# EAGLE schematic MaTouch ESP32-S3 7.5“ Eink AI Mic Array V1.0 (EAGLE 6.1)
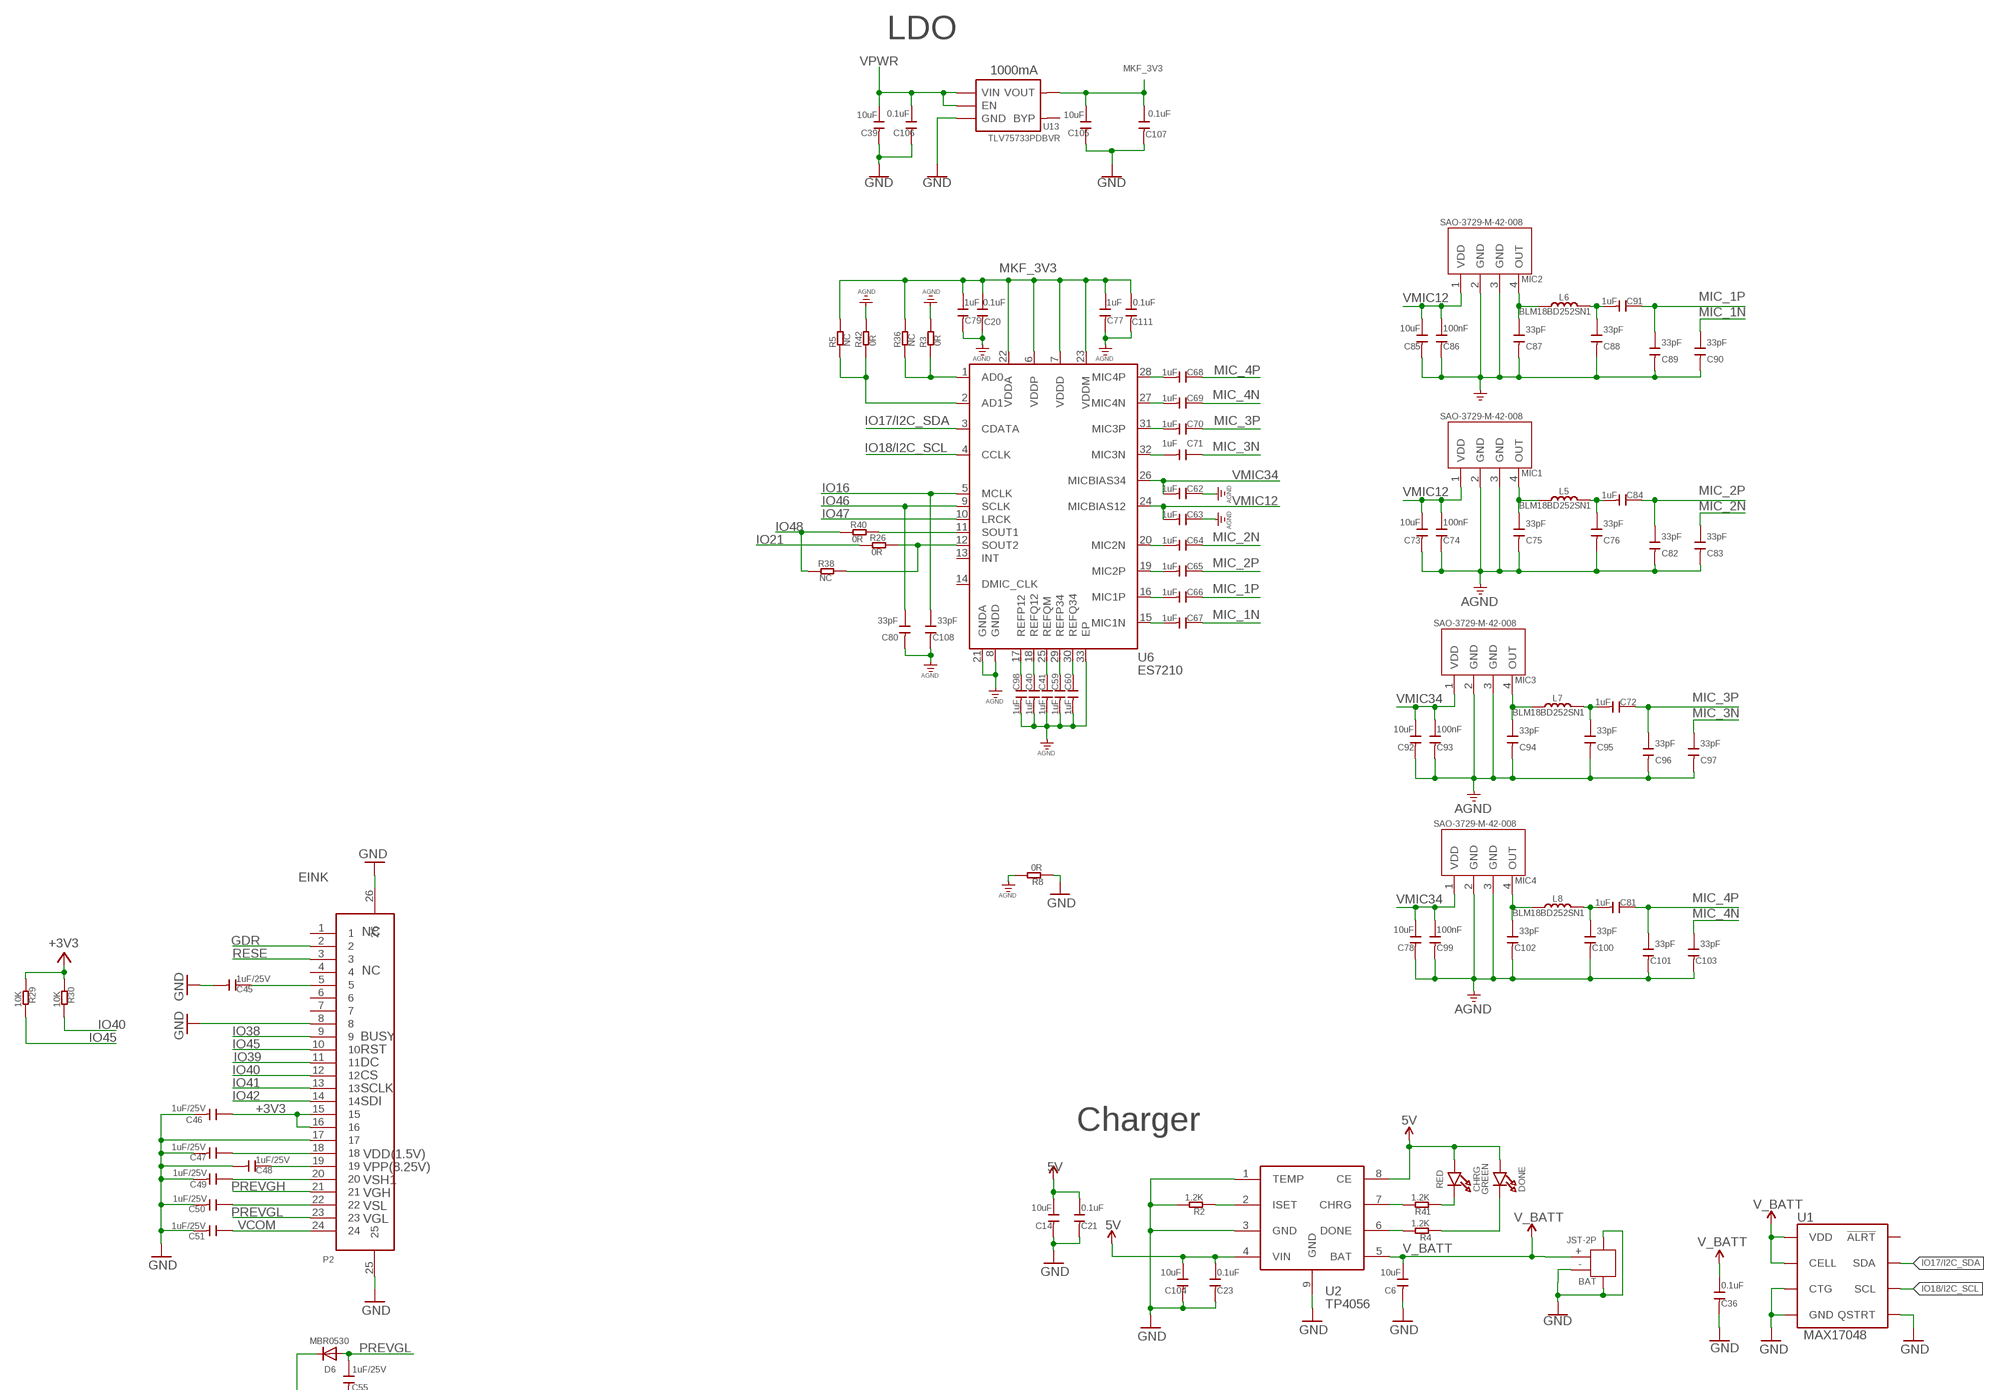
[diagram p0: schematic, sheet 1, part 1 of 3]
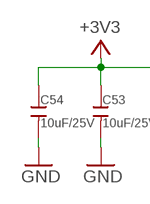
[diagram p1: schematic, sheet 1, part 2 of 3]
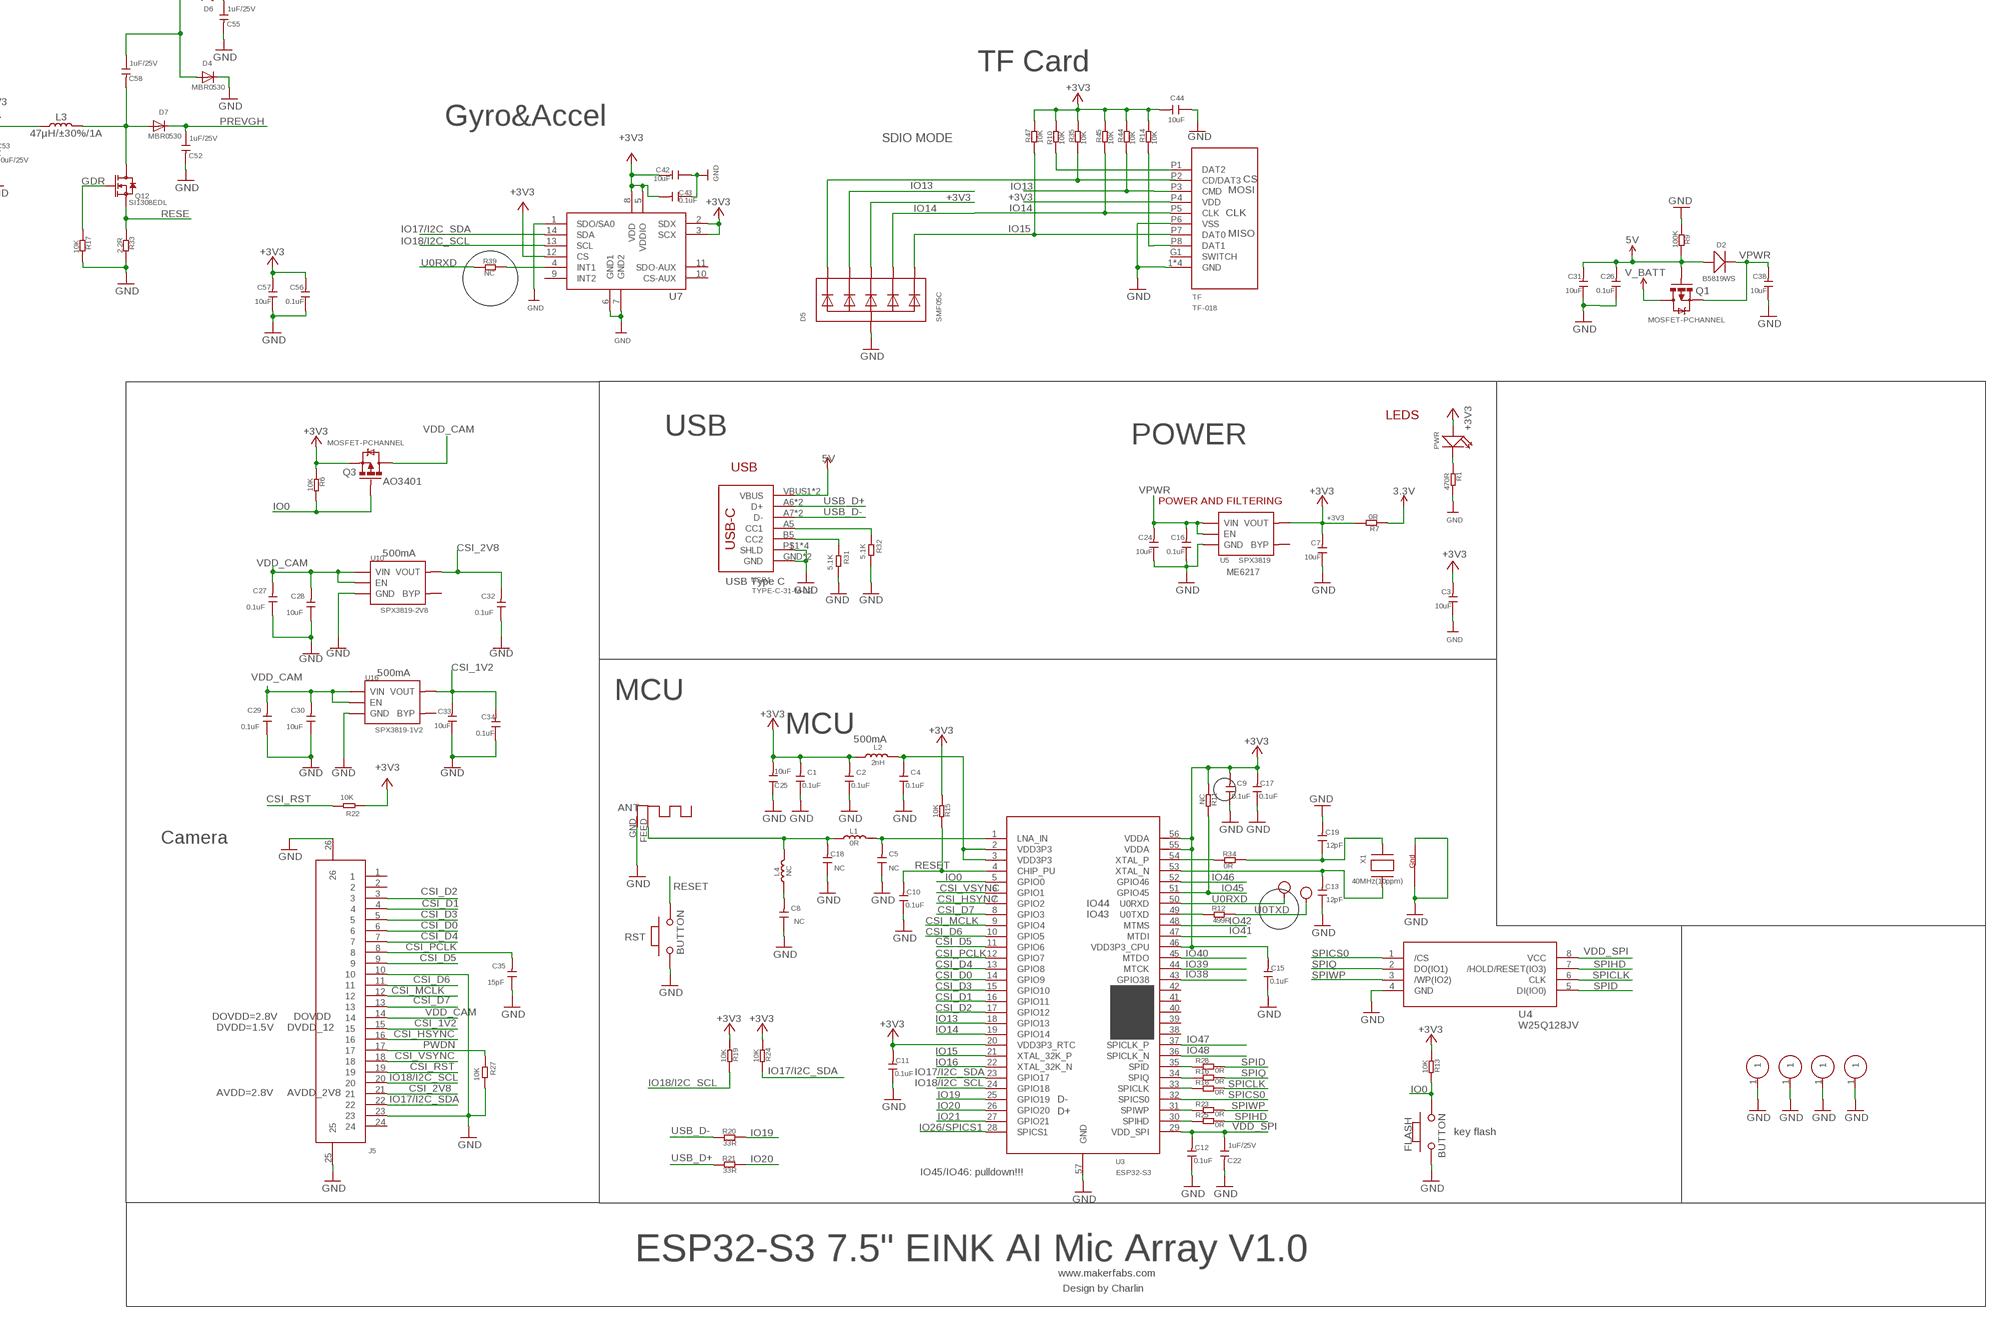
[diagram p2: schematic, sheet 1, part 3 of 3]

## Parts
ANT1  ANTENNA  [RN-ANT]
BAT  JST-2P  JST-2P-SMD'2.0'  [HW2-SMD-2.0-90D]
C1  0.1uF  DISCRETE_C-0402  [DISCRETE_C0402]
C2  0.1uF  DISCRETE_C-0402  [DISCRETE_C0402]
C3  10uF  DISCRETE_C-0402  [DISCRETE_C0402]
C4  0.1uF  DISCRETE_C-0402  [DISCRETE_C0402]
C5  NC  DISCRETE_C-0402  [DISCRETE_C0402]
C6  10uF  DISCRETE_C-0402  [DISCRETE_C0402]
C7  10uF  DISCRETE_C-0402  [DISCRETE_C0402]
C8  NC  DISCRETE_C-0402  [DISCRETE_C0402]
C9  0.1uF  DISCRETE_C-0402  [DISCRETE_C0402]
C10  0.1uF  DISCRETE_C-0402  [DISCRETE_C0402]
C11  0.1uF  DISCRETE_C-0402  [DISCRETE_C0402]
C12  0.1uF  DISCRETE_C-0402  [DISCRETE_C0402]
C13  12pF  DISCRETE_C-0402  [DISCRETE_C0402]
C14  10uF  DISCRETE_C-0402  [DISCRETE_C0402]
C15  0.1uF  DISCRETE_C-0402  [DISCRETE_C0402]
C16  0.1uF  DISCRETE_C-0402  [DISCRETE_C0402]
C17  0.1uF  DISCRETE_C-0402  [DISCRETE_C0402]
C18  NC  DISCRETE_C-0402  [DISCRETE_C0402]
C19  12pF  DISCRETE_C-0402  [DISCRETE_C0402]
C20  0.1uF  DISCRETE_C-0402  [DISCRETE_C0402]
C21  0.1uF  DISCRETE_C-0402  [DISCRETE_C0402]
C22  1uF/25V  DISCRETE_C-0402  [DISCRETE_C0402]
C23  0.1uF  DISCRETE_C-0402  [DISCRETE_C0402]
C24  10uF  DISCRETE_C-0402  [DISCRETE_C0402]
C25  10uF  DISCRETE_C-0603  [DISCRETE_C0603]
C26  0.1uF  DISCRETE_C-0402  [DISCRETE_C0402]
C27  0.1uF  DISCRETE_C-0402  [DISCRETE_C0402]
C28  10uF  DISCRETE_C-0402  [DISCRETE_C0402]
C29  0.1uF  DISCRETE_C-0402  [DISCRETE_C0402]
C30  10uF  DISCRETE_C-0402  [DISCRETE_C0402]
C31  10uF  DISCRETE_C-0402  [DISCRETE_C0402]
C32  0.1uF  DISCRETE_C-0402  [DISCRETE_C0402]
C33  10uF  DISCRETE_C-0402  [DISCRETE_C0402]
C34  0.1uF  DISCRETE_C-0402  [DISCRETE_C0402]
C35  15pF  DISCRETE_C-0402  [DISCRETE_C0402]
C36  0.1uF  DISCRETE_C-0402  [DISCRETE_C0402]
C38  10uF  DISCRETE_C-0402  [DISCRETE_C0402]
C39  10uF  DISCRETE_C-0402  [DISCRETE_C0402]
C40  1uF  DISCRETE_C-0402  [DISCRETE_C0402]
C41  1uF  DISCRETE_C-0402  [DISCRETE_C0402]
C42  10uF  DISCRETE_C-0402  [DISCRETE_C0402]
C43  0.1uF  DISCRETE_C-0402  [DISCRETE_C0402]
C44  10uF  DISCRETE_C-0402  [DISCRETE_C0402]
C45  1uF/25V  DISCRETE_C-0402  [DISCRETE_C0402]
C46  1uF/25V  DISCRETE_C-0402  [DISCRETE_C0402]
C47  1uF/25V  DISCRETE_C-0402  [DISCRETE_C0402]
C48  1uF/25V  DISCRETE_C-0402  [DISCRETE_C0402]
C49  1uF/25V  DISCRETE_C-0402  [DISCRETE_C0402]
C50  1uF/25V  DISCRETE_C-0402  [DISCRETE_C0402]
C51  1uF/25V  DISCRETE_C-0402  [DISCRETE_C0402]
C52  1uF/25V  DISCRETE_C-0402  [DISCRETE_C0402]
C53  10uF/25V  C-0603  [C0603]
C54  10uF/25V  C-0603  [C0603]
C55  1uF/25V  DISCRETE_C-0402  [DISCRETE_C0402]
C56  0.1uF  DISCRETE_C-0402  [DISCRETE_C0402]
C57  10uF  DISCRETE_C-0402  [DISCRETE_C0402]
C58  1uF/25V  DISCRETE_C-0402  [DISCRETE_C0402]
C59  1uF  DISCRETE_C-0402  [DISCRETE_C0402]
C60  1uF  DISCRETE_C-0402  [DISCRETE_C0402]
C62  1uF  DISCRETE_C-0402  [DISCRETE_C0402]
C63  1uF  DISCRETE_C-0402  [DISCRETE_C0402]
C64  1uF  DISCRETE_C-0402  [DISCRETE_C0402]
C65  1uF  DISCRETE_C-0402  [DISCRETE_C0402]
C66  1uF  DISCRETE_C-0402  [DISCRETE_C0402]
C67  1uF  DISCRETE_C-0402  [DISCRETE_C0402]
C68  1uF  DISCRETE_C-0402  [DISCRETE_C0402]
C69  1uF  DISCRETE_C-0402  [DISCRETE_C0402]
C70  1uF  DISCRETE_C-0402  [DISCRETE_C0402]
C71  1uF  DISCRETE_C-0402  [DISCRETE_C0402]
C72  1uF  DISCRETE_C-0402  [DISCRETE_C0402]
C73  10uF  DISCRETE_C-0402  [DISCRETE_C0402]
C74  100nF  DISCRETE_C-0402  [DISCRETE_C0402]
C75  33pF  DISCRETE_C-0402  [DISCRETE_C0402]
C76  33pF  DISCRETE_C-0402  [DISCRETE_C0402]
C77  1uF  DISCRETE_C-0402  [DISCRETE_C0402]
C78  10uF  DISCRETE_C-0402  [DISCRETE_C0402]
C79  1uF  DISCRETE_C-0402  [DISCRETE_C0402]
C80  33pF  DISCRETE_C-0402  [DISCRETE_C0402]
C81  1uF  DISCRETE_C-0402  [DISCRETE_C0402]
C82  33pF  DISCRETE_C-0402  [DISCRETE_C0402]
C83  33pF  DISCRETE_C-0402  [DISCRETE_C0402]
C84  1uF  DISCRETE_C-0402  [DISCRETE_C0402]
C85  10uF  DISCRETE_C-0402  [DISCRETE_C0402]
C86  100nF  DISCRETE_C-0402  [DISCRETE_C0402]
C87  33pF  DISCRETE_C-0402  [DISCRETE_C0402]
C88  33pF  DISCRETE_C-0402  [DISCRETE_C0402]
C89  33pF  DISCRETE_C-0402  [DISCRETE_C0402]
C90  33pF  DISCRETE_C-0402  [DISCRETE_C0402]
C91  1uF  DISCRETE_C-0402  [DISCRETE_C0402]
C92  10uF  DISCRETE_C-0402  [DISCRETE_C0402]
C93  100nF  DISCRETE_C-0402  [DISCRETE_C0402]
C94  33pF  DISCRETE_C-0402  [DISCRETE_C0402]
C95  33pF  DISCRETE_C-0402  [DISCRETE_C0402]
C96  33pF  DISCRETE_C-0402  [DISCRETE_C0402]
C97  33pF  DISCRETE_C-0402  [DISCRETE_C0402]
C98  1uF  DISCRETE_C-0402  [DISCRETE_C0402]
C99  100nF  DISCRETE_C-0402  [DISCRETE_C0402]
C100  33pF  DISCRETE_C-0402  [DISCRETE_C0402]
C101  33pF  DISCRETE_C-0402  [DISCRETE_C0402]
C102  33pF  DISCRETE_C-0402  [DISCRETE_C0402]
C103  33pF  DISCRETE_C-0402  [DISCRETE_C0402]
C104  10uF  DISCRETE_C-0402  [DISCRETE_C0402]
C105  10uF  DISCRETE_C-0402  [DISCRETE_C0402]
C106  0.1uF  DISCRETE_C-0402  [DISCRETE_C0402]
C107  0.1uF  DISCRETE_C-0402  [DISCRETE_C0402]
C108  33pF  DISCRETE_C-0402  [DISCRETE_C0402]
C111  0.1uF  DISCRETE_C-0402  [DISCRETE_C0402]
CHRG  RED  LED0805_NOOUTLINE  [CHIPLED_0805_NOOUTLINE]
D2  B5819WS  D'0805'  [SOD323]
D4  MBR0530  DIODESOD-323F  [SOD-323F]
D5  SMF05C  TVSARRAY_5LANE  [SOT363]
D6  MBR0530  DIODESOD-323F  [SOD-323F]
D7  MBR0530  DIODESOD-323F  [SOD-323F]
DONE  GREEN  LED0805_NOOUTLINE  [CHIPLED_0805_NOOUTLINE]
FLASH  BUTTON  PB157  [157SW]
J5  FPC-24P  [SMD26-50P-1760L450W]
L1  0R  DISCRETE_L0402  [DISCRETE_L0402]
L2  2nH  DISCRETE_L0603  [DISCRETE_L0603]
L3  47µH/±30%/1A  INDUCTOR-CR54-47UH  [CR54]
L4  NC  DISCRETE_L0402  [DISCRETE_L0402]
L5  BLM18BD252SN1  INDUCTOR/FERRITE-BEAD'0603'  [L0603]
L6  BLM18BD252SN1  INDUCTOR/FERRITE-BEAD'0603'  [L0603]
L7  BLM18BD252SN1  INDUCTOR/FERRITE-BEAD'0603'  [L0603]
L8  BLM18BD252SN1  INDUCTOR/FERRITE-BEAD'0603'  [L0603]
MIC1  SAO-3729-M-42-008  MIC-MSM421A3729H8-C  [MIC4-SMD-3.76X2.95MM]
MIC2  SAO-3729-M-42-008  MIC-MSM421A3729H8-C  [MIC4-SMD-3.76X2.95MM]
MIC3  SAO-3729-M-42-008  MIC-MSM421A3729H8-C  [MIC4-SMD-3.76X2.95MM]
MIC4  SAO-3729-M-42-008  MIC-MSM421A3729H8-C  [MIC4-SMD-3.76X2.95MM]
P2  FPC-24P  [SMD26-50P-1760L450W]
PWR  DISCRETE_LED0603  [DISCRETE_LED-0603]
Q1  MOSFET-PCHANNEL  [SOT23-3]
Q3  MOSFET-PCHANNEL  [SOT23-3]
Q12  SI1308EDL  MOSFET-N'SOT23'  [SOT23]
R1  470R  DISCRETE_R-0402  [DISCRETE_R0402]
R2  1.2K  DISCRETE_R-0402  [DISCRETE_R0402]
R3  0R  DISCRETE_R-0402  [DISCRETE_R0402]
R4  1.2K  DISCRETE_R-0402  [DISCRETE_R0402]
R5  NC  DISCRETE_R-0402  [DISCRETE_R0402]
R6  10K  DISCRETE_R-0402  [DISCRETE_R0402]
R7  0R  DISCRETE_R-0402  [DISCRETE_R0402]
R8  0R  DISCRETE_R-0402  [DISCRETE_R0402]
R9  100K  DISCRETE_R-0402  [DISCRETE_R0402]
R10  10K  DISCRETE_R-0402  [DISCRETE_R0402]
R11  NC  DISCRETE_R-0402  [DISCRETE_R0402]
R12  499R  DISCRETE_R-0402  [DISCRETE_R0402]
R13  10K  DISCRETE_R-0402  [DISCRETE_R0402]
R14  10K  DISCRETE_R-0402  [DISCRETE_R0402]
R15  10K  DISCRETE_R-0402  [DISCRETE_R0402]
R16  0R  DISCRETE_R-0402  [DISCRETE_R0402]
R17  10K  DISCRETE_R-0402  [DISCRETE_R0402]
R18  0R  DISCRETE_R-0402  [DISCRETE_R0402]
R19  10K  DISCRETE_R-0402  [DISCRETE_R0402]
R20  33R  DISCRETE_R-0402  [DISCRETE_R0402]
R21  33R  DISCRETE_R-0402  [DISCRETE_R0402]
R22  10K  DISCRETE_R-0402  [DISCRETE_R0402]
R23  0R  DISCRETE_R-0402  [DISCRETE_R0402]
R24  10K  DISCRETE_R-0402  [DISCRETE_R0402]
R25  0R  DISCRETE_R-0402  [DISCRETE_R0402]
R26  0R  DISCRETE_R-0402  [DISCRETE_R0402]
R27  10K  DISCRETE_R-0402  [DISCRETE_R0402]
R28  0R  DISCRETE_R-0402  [DISCRETE_R0402]
R29  10K  DISCRETE_R-0402  [DISCRETE_R0402]
R30  10K  DISCRETE_R-0402  [DISCRETE_R0402]
R31  5.1K  DISCRETE_R-0402  [DISCRETE_R0402]
R32  5.1K  DISCRETE_R-0402  [DISCRETE_R0402]
R33  2.2R  DISCRETE_R-0402  [DISCRETE_R0402]
R34  0R  DISCRETE_R-0402  [DISCRETE_R0402]
R35  10K  DISCRETE_R-0402  [DISCRETE_R0402]
R36  NC  DISCRETE_R-0402  [DISCRETE_R0402]
R38  NC  DISCRETE_R-0402  [DISCRETE_R0402]
R39  NC  DISCRETE_R-0402  [DISCRETE_R0402]
R40  0R  DISCRETE_R-0402  [DISCRETE_R0402]
R41  1.2K  DISCRETE_R-0402  [DISCRETE_R0402]
R42  0R  DISCRETE_R-0402  [DISCRETE_R0402]
R44  10K  DISCRETE_R-0402  [DISCRETE_R0402]
R45  10K  DISCRETE_R-0402  [DISCRETE_R0402]
R47  10K  DISCRETE_R-0402  [DISCRETE_R0402]
RST  BUTTON  PB157  [157SW]
RX  TEST-POINT'4545'  [TP-D45MIL]
S1  ONEPIN01  [ONEPIN01]
S2  ONEPIN01  [ONEPIN01]
S3  ONEPIN01  [ONEPIN01]
S4  ONEPIN01  [ONEPIN01]
TF  TF-018  [TF-018]
TX  TEST-POINT'4545'  [TP-D45MIL]
U1  MAX17048  MAX17048DFN8  [DFN-8]
U2  TP4056  [SOP8-1.27P]
U3  ESP32-S3  [QFN56-7*7MM]
U4  W25Q128JV  [SOIC-8-208MIL]
U5  SPX3819  [SOT23-5]
U6  ES7210  [QFN33-40P400L400W75H-280X280]
U7  QMI8658A  [LGA14-50P-300L250W86H]
U10  SPX3819-2V8  SPX3819  [SOT23-5]
U13  TLV75733PDBVR  SPX3819  [SOT23-5]
U16  SPX3819-1V2  SPX3819  [SOT23-5]
USB1  TYPE-C-31-M-12  [TYPE-C-31-M-12]
X1  40MHz(10ppm)  XTAL-4-3225  [NX3225]

## Nets
3.3V: R7.2
5V: C14.1 C21.1 C23.1 C26.2 C31.2 C104.1 CHRG.A D2.+ DONE.A Q1.1(G) R9.2 U2.4(VIN) U2.8(CE) USB1.VBUS1(VBUS) USB1.VBUS2(VBUS)
+3V3: C1.2 C2.2 C3.2 C7.2 C9.2 C11.2 C15.2 C17.2 C25.2 C42.2 C43.2 C44.2 C46.1 C53.1 C54.1 C56.2 C57.2 D5.4(C3) L2.1 L3.P$1 P2.15 P2.16 PWR.+ Q3.2(S) R6.2 R7.1 R10.2 R11.2 R13.2 R14.2 R15.2 R19.2 R22.1 R24.2 R29.1 R30.1 R35.2 R44.2 R45.2 R47.2 TF.P4(VDD) U3.20(VDD3P3_RTC) U3.46(VDD3P3_CPU) U3.55(VDDA) U3.56(VDDA) U5.5(VOUT) U7.2(SDX) U7.3(SCX) U7.5(VDDIO) U7.8(VDD) U7.12(CS)
AGND: C20.2 C40.2 C41.2 C59.2 C60.2 C62.1 C63.1 C73.2 C74.2 C75.2 C76.2 C77.2 C78.2 C79.2 C80.2 C82.2 C83.2 C85.2 C86.2 C87.2 C88.2 C89.2 C90.2 C92.2 C93.2 C94.2 C95.2 C96.2 C97.2 C98.2 C99.2 C100.2 C101.2 C102.2 C103.2 C108.2 C111.2 MIC1.2(GND) MIC1.3(GND) MIC2.2(GND) MIC2.3(GND) MIC3.2(GND) MIC3.3(GND) MIC4.2(GND) MIC4.3(GND) R3.1 R8.1 R42.1 U6.8(GNDD) U6.21(GNDA) U6.33(EP) ; supply symbol labelled GND_POWER
CSI_1V2: C33.2 C34.2 J5.15 U16.5(VOUT)
CSI_2V8: C32.2 J5.21 U10.5(VOUT)
CSI_D0: J5.6 U3.14(GPIO9)
CSI_D1: J5.4 U3.16(GPIO11)
CSI_D2: J5.3 U3.17(GPIO12)
CSI_D3: J5.5 U3.15(GPIO10)
CSI_D4: J5.7 U3.13(GPIO8)
CSI_D5: J5.9 U3.11(GPIO6)
CSI_D6: J5.11 U3.10(GPIO5)
CSI_D7: J5.13 U3.8(GPIO3)
CSI_HSYNC: J5.16 U3.7(GPIO2)
CSI_MCLK: J5.12 U3.9(GPIO4)
CSI_PCLK: C35.2 J5.8 U3.12(GPIO7)
CSI_RST: J5.19 R22.2
CSI_VSYNC: J5.18 U3.6(GPIO1)
GDR: P2.2 Q12.1(G) R17.1
GND: ANT1.GND BAT.3 BAT.4 BAT.- C1.1 C2.1 C3.1 C4.1 C5.1 C6.2 C7.1 C8.1 C9.1 C10.1 C11.1 C12.1 C13.1 C14.2 C15.1 C16.1 C17.1 C18.1 C19.2 C21.2 C22.2 C23.2 C24.1 C25.1 C26.1 C27.1 C28.1 C29.1 C30.1 C31.1 C32.1 C33.1 C34.1 C35.1 C36.2 C38.1 C39.2 C42.1 C43.1 C44.1 C45.2 C46.2 C47.2 C48.2 C49.2 C50.2 C51.2 C52.2 C53.2 C54.2 C55.2 C56.1 C57.1 C104.2 C105.2 C106.2 C107.2 D4.C D5.2(A) FLASH.1 J5.10 J5.23 J5.25 J5.26 P2.8 P2.17 P2.25 P2.26 R1.1 R2.1 R8.2 R9.1 R17.2 R27.2 R31.2 R32.2 R33.2 RST.1 S1.1 S2.1 S3.1 S4.1 TF.1(GND) TF.2(GND) TF.3(GND) TF.4(GND) TF.P6(VSS) U1.1(CTG) U1.4(GND) U1.6(QSTRT) U1.9(GND) U2.1(TEMP) U2.3(GND) U2.9(GND) U3.57(GND) U4.4(GND) U5.2(GND) U7.1(SDO/SA0) U7.6(GND1) U7.7(GND2) U10.2(GND) U13.2(GND) U16.2(GND) USB1.GND USB1.GND2(GND) USB1.P$1(SHLD) USB1.P$2(SHLD) USB1.P$3(SHLD) USB1.P$4(SHLD) X1.2(G2) X1.4(G1)
IO0: FLASH.2 Q3.1(G) R6.1 R13.1 U3.5(GPIO0)
IO13: D5.3(C2) R44.1 TF.P3(CMD) U3.18(GPIO13)
IO14: D5.5(C4) R45.1 TF.P5(CLK) U3.19(GPIO14)
IO15: D5.6(C5) R47.1 TF.P7(DAT0) U3.21(XTAL_32K_P)
IO16: C108.1 U3.22(XTAL_32K_N) U6.5(MCLK)
IO17/I2C_SDA: J5.22 R24.1 U1.8(SDA) U3.23(GPIO17) U6.3(CDATA) U7.14(SDA)
IO18/I2C_SCL: J5.20 R19.1 U1.7(SCL) U3.24(GPIO18) U6.4(CCLK) U7.13(SCL)
IO19: R20.1 U3.25(GPIO19)
IO20: R21.1 U3.26(GPIO20)
IO21: R26.2 U3.27(GPIO21)
IO26/SPICS1: U3.28(SPICS1)
IO38: P2.9 U3.43(GPIO38)
IO39: P2.11 U3.44(MTCK)
IO40: P2.12 R30.2 U3.45(MTDO)
IO41: P2.13 U3.47(MTDI)
IO42: P2.14 U3.48(MTMS)
IO45: P2.10 R11.1 R29.2 U3.51(GPIO45)
IO46: C80.1 U3.52(GPIO46) U6.9(SCLK)
IO47: U3.37(SPICLK_P) U6.10(LRCK)
IO48: R38.2 R40.2 U3.36(SPICLK_N)
MIC_1N: C67.1 C90.1
MIC_1P: C66.1 C89.1 C91.1
MIC_2N: C64.1 C83.1
MIC_2P: C65.1 C82.1 C84.1
MIC_3N: C71.1 C97.1
MIC_3P: C70.1 C72.1 C96.1
MIC_4N: C69.1 C103.1
MIC_4P: C68.1 C81.1 C101.1
MKF_3V3: C20.1 C77.1 C79.1 C105.1 C107.1 C111.1 R5.1 R36.1 U6.6(VDDP) U6.7(VDDD) U6.22(VDDA) U6.23(VDDM) U13.5(VOUT)
N$1: ANT1.FEED C18.2 L1.1 L4.2
N$2: C5.2 L1.2 U3.1(LNA_IN)
N$3: R28.2 U3.35(SPID)
N$4: C8.2 L4.1
N$5: R32.1 USB1.A5(CC1)
N$6: C45.1 P2.5
N$7: PWR.- R1.2
N$8: C48.1 P2.19
N$9: C49.1 P2.20
N$10: C50.1 P2.22
N$11: C58.1 D4.A D6.C
N$12: R2.2 U2.2(ISET)
N$13: R41.1 U2.7(CHRG)
N$14: R4.1 U2.6(DONE)
N$15: CHRG.C R41.2
N$16: DONE.C R4.2
N$17: C98.1 U6.17(REFP12)
N$18: C40.1 U6.18(REFQ12)
N$19: C41.1 U6.25(REFQM)
N$20: C59.1 U6.29(REFP34)
N$21: R10.1 TF.P1(DAT2)
N$22: C47.1 P2.18
N$23: C60.1 U6.30(REFQ34)
N$24: C67.2 U6.15(MIC1N)
N$25: C66.2 U6.16(MIC1P)
N$26: C64.2 U6.20(MIC2N)
N$27: C70.2 U6.31(MIC3P)
N$28: R14.1 TF.P8(DAT1)
N$29: D5.1(C1) R35.1
N$30: C65.2 U6.19(MIC2P)
N$31: C76.1 C84.2 L5.2
N$32: R3.2 R36.2 U6.1(AD0)
N$33: C4.2 L2.2 U3.2(VDD3P3) U3.3(VDD3P3)
N$34: R31.1 USB1.B5(CC2)
N$35: R16.2 U3.34(SPIQ)
N$36: R40.1 U6.11(SOUT1)
N$37: R34.2 U3.54(XTAL_P)
N$38: R18.2 U3.33(SPICLK)
N$39: C71.2 U6.32(MIC3N)
N$40: R23.2 U3.31(SPIWP)
N$41: R25.2 U3.30(SPIHD)
N$42: R39.1 U7.4(INT1)
N$43: C75.1 L5.1 MIC1.4(OUT)
N$44: C88.1 C91.2 L6.2
N$45: C87.1 L6.1 MIC2.4(OUT)
N$46: C69.2 U6.27(MIC4N)
N$47: C81.2 C100.1 L8.2
N$48: C72.2 C95.1 L7.2
N$49: C68.2 U6.28(MIC4P)
N$50: R26.1 R38.1 U6.12(SOUT2)
N$51: C94.1 L7.1 MIC3.4(OUT)
N$61: R5.2 R42.2 U6.2(AD1)
N$63: R12.2 U3.49(U0TXD)
N$65: C13.2 U3.53(XTAL_N) X1.3(X2)
N$66: C19.1 R34.1 X1.1(X1)
N$67: C102.1 L8.1 MIC4.4(OUT)
N$71: C58.2 D7.A L3.P$2 Q12.3(D)
PREVGH: C52.1 D7.C P2.21
PREVGL: C55.1 D6.A P2.23
PWDN: J5.17 R27.1
RESE: P2.3 Q12.2(S) R33.1
RESET: C10.2 R15.1 RST.2 U3.4(CHIP_PU)
SPICLK: R18.1 U4.6(CLK)
SPICS0: U3.32(SPICS0) U4.1(/CS)
SPID: R28.1 U4.5(DI(IO0))
SPIHD: R25.1 U4.7(/HOLD/RESET(IO3))
SPIQ: R16.1 U4.2(DO(IO1))
SPIWP: R23.1 U4.3(/WP(IO2))
U0RXD: R39.2 RX.T U3.50(U0RXD)
U0TXD: R12.1 TX.T
USB_D+: R21.2 USB1.A6(D+) USB1.B6(D+)
USB_D-: R20.2 USB1.A7(D-) USB1.B7(D-)
V_BATT: BAT.+ C6.1 C36.1 Q1.3(D) U1.2(CELL) U1.3(VDD) U2.5(BAT)
VCOM: C51.1 P2.24
VDD_CAM: C27.2 C28.2 C29.2 C30.2 J5.14 Q3.3(D) U10.1(VIN) U10.3(EN) U16.1(VIN) U16.3(EN)
VDD_SPI: C12.2 C22.1 U3.29(VDD_SPI) U4.8(VCC)
VMIC12: C63.2 C73.1 C74.1 C85.1 C86.1 MIC1.1(VDD) MIC2.1(VDD) U6.24(MICBIAS12)
VMIC34: C62.2 C78.1 C92.1 C93.1 C99.1 MIC3.1(VDD) MIC4.1(VDD) U6.26(MICBIAS34)
VPWR: C16.2 C24.2 C38.2 C39.1 C106.1 D2.- Q1.2(S) U5.1(VIN) U5.3(EN) U13.1(VIN) U13.3(EN)
Unconnected: J5.1 J5.2 J5.24 P2.1 P2.4 P2.6 P2.7 TF.G1(SWITCH) TF.P2(CD/DAT3) U1.5(!ALRT) U3.38(GPIO33) U3.39(GPIO34) U3.40(GPIO35) U3.41(GPIO36) U3.42(GPIO37) U5.4(BYP) U6.13(INT) U6.14(DMIC_CLK) U7.9(INT2) U7.10(CS-AUX) U7.11(SDO-AUX) U10.4(BYP) U13.4(BYP) U16.4(BYP)

## Notes on the sheet
- LDO
- 1000mA
- EINK
- NC
- NC
- BUSY
- RST
- DC
- CS
- SCLK
- SDI
- Charger
- VDD(1.5V)
- VPP(8.25V)
- VSH1
- VGH
- VSL
- VGL
- TF Card
- Gyro&Accel
- SDIO MODE
- CS
- MOSI
- CLK
- MISO
- LEDS
- USB | POWER
- USB
- AO3401
- POWER AND FILTERING
- 500mA
- ME6217
- USB Type C
- 500mA
- MCU
- MCU
- 500mA
- ANT
- Camera
- IO44
- IO43
- DOVDD=2.8V | DOVDD
- DVDD=1.5V | DVDD_12
- AVDD=2.8V | AVDD_2V8
- D-
- D+
- key flash
- IO45/IO46: pulldown!!!
- ESP32-S3 7.5" EINK AI Mic Array V1.0
- www.makerfabs.com
- Design by Charlin

## Library data of the parts
ANT1 = adafruit:ANTENNA
BAT = Connector-new:JST-2P-SMD: 2P-SMD-1.0-90D:320110054;2P-SMD-2.0-90D:320110026
C1-C36 C38-C52 C55-C60 C62-C108 C111 = A9G:DISCRETE_C*: Ceramic Capacitors
C53 C54 = Discrete:C*: Ceramic Capacitors
CHRG DONE = microbuilder:LED: LED 0603 - 0603 Surface Mount Package 2mA: Green LED - Low Power (3.9mcd, 2ma, 1.7Vf) - Digikey: 475-2709-2-ND Orange LED - Low Power (9.8mcd, 2ma, 1.8Vf) - Digikey: 475-1194-2-ND Red LED - Low Power (5mcd, 2ma, 1.8Vf) - Digikey: 475-1195-2-ND Yellow LED - Low Power (7mcd, 2ma, 1.8Vf) - Digikey: 475-1196-2-ND 5mA: Blue LED - Low Power (17mcd, 5ma, 2.9Vf) - Digikey: LNJ937W8CRACT-ND 0805 - 0805 Surface Mount Package 2mA: Red LED (8.8mcd, 2mA, 1.8Vf, Clear) - Low Power [Digikey: 475-2510-1-ND] Green LED (5mcd, 2mA, 1.8Vf, Clear) - Low Power [Digikey: 475-2730-1-ND] Yellow LED (11.3mcd, 2mA, 1.8Vf, Clear) - Low Power [Digikey: 475-2555-1-ND] 20mA: Red LED (104mcd, 20mA, Diffused) - LS R976 [Digikey: 475-1278-6-ND] Red LED (12mcd, 20mA, 2.0Vf, Clear) - APT2012EC [Digikey: 754-1128-1-ND] Green LED (15mcd, 20mA, 2.2Vf, Clear) - APT2012GC [Digikey: 754-1131-1-ND] Orange LED (160mcd, 20mA, 2.1Vf, Clear) - APT2012SECK [Digikey: 754-1130-1-ND] 1206 - 1206 Surface Mount Package Green LED (26mcd, 20mA, Diffused) - LG N971 [Digikey: 475-1407-6-ND] Red LED (15mcd, 20mA, Diffused) - LH N974 [Digikey: 475-1416-6-ND] Cree - Cree High-Power Surface Mount LEDs XPEBWT-L1-0000-00D50 - White 111lm 350mA 2.9Vf 6200K 110° XTEAWT-00-0000-00000LEE3 - White 114lm 350mA 2.85Vf 5000K 115° Everlight - Everlight 45-21 Series Surface Mount LEDs 45-21/QK2C-B2832AC2CB2/2T - Warm White 2000mcd 20mA 3.25Vf 3050K 120° 45-21/LK2C-B38452C4CB2/2T - Nuetral White 2000mcd 20mA 3.25Vf 4150K 120° 45-21/LK2C-B50634C6CB2/2T - Cold White 2200mcd 20mA 3.25Vf 5650K 120° PLCC2 Reverse Mount LS T77K-J1L2-1-0-2-R18-Z - Red 11.25mcd 2mA 1.8Vf 630nm 120° LO T77K-L1M2-24-Z - Orange 19.6mcd 2mA 1.8Vf 606nm 120° LY T77K-K2M1-26-Z - Yellow 15.7mcd 2mA 1.8Vf 587nm 120°
D2 = Discrete:D*
D4 D6 D7 = adafruit2:DIODE: Diode SMADIODE - SMA Surface Mount Package 20V 1A Schottky Diode Digikey: 641-1014-6-ND DO-1N4148 - Through Hole Small Current Diode SOD-123 20V 1 A (.5mV Vf) Schottky Diode - Digikey: MBRX120TPMSCT-ND SOD-323 10V 570mA (.38mV Vf, 3ns) Schottky Diode - Digikey: ZLLS410CT-ND SOD-523 30V 30mA Schottky Diode (RB751S-40TE61) - Digikey: RB751S-40TE61CT-ND SOT23-R/W - SOT23 Package (R = Solder Paste/Reflow Ovens, W = Hand-Soldering) BAT54Film 40V 300mA - Digikey: 497-7162-1-ND
D5 = microbuilder:TVSARRAY_5LANE: Voltage Transient Suppressor Array SOT363 SMF05C - 100W 5V: Digikey - SMF05CT1GOSCT-ND
FLASH RST = MySMD:PB157
J5 P2 = self:FPC-24P
L1 L2 L4 = A9G:DISCRETE_L*
L3 = SparkFun-Coils:INDUCTOR: Inductors Resist changes in electrical current. Basically a coil of wire. SparkFun Products: SparkFun Load Cell Amplifier - HX711 <https://www.sparkfun.com/products/13879> IOIO-OTG - V2.2 <https://www.sparkfun.com/products/13613>; PROD_ID: NDUC-10789; VALUE: 47µH/±30%/750mA
L5-L8 = Discrete-new:INDUCTOR/FERRITE-BEAD
MIC1-MIC4 = Connector-new:MIC-MSM421A3729H8-C
PWR = A9G:DISCRETE_LED*
Q1 Q3 = User-Submitted:MOSFET-PCHANNEL: Generic PMOSFET IRLML2244 - TRANS-11153 (SOT-23 -20V -4.3A) (1.Gate 2.Source 3.Drain) FQP27P06 - COM-10349 <http://www.sparkfun.com/products/10349> (TO-220 -60V -27A) (1.Gate 2.Source 3.Drain); PROD_ID: TRANS-08285
Q12 = Discrete:MOSFET-N: IRLL014: http://www.vishay.com/docs/91319/sihll014.pdf
R1-R36 R38-R42 R44 R45 R47 = A9G:DISCRETE_R*
RX TX = Discrete-new:TEST-POINT; PARTNO: DNP
S1-S4 = user:ONEPIN01
TF = sale:TF-018
U1 = SparkFun-IC-Power:MAX17048: Micropower 1-Cell Li+ ModelGauge SparkFun Products Qduino Mini <https://www.sparkfun.com/products/13614> (DEV-13614); PROD_ID: IC-12551
U2 = self:TP4056
U3 = sale:ESP32-S3
U4 = self:W25Q128JV
U5 U10 U13 U16 = IC:SPX3819
U6 = user:ES7210
U7 = user:QMI8658A
USB1 = sale:TYPE-C-31-M-12
X1 = adafruit:XTAL-4: Classic 4-pin 3.2 x 2.5mm crystal

## Net classes
0 default: width 0.203 mm, drill 0.305 mm, clearance 0.152 mm
1 vbat: width 0.254 mm, drill 0.305 mm, clearance 0.203 mm